# EasyEDA Pro project MSDRv4.eprj

# Schematic Schematic1
Board Name: Board1; Create Date: 2025-03-24; Page Name: P1; Project Name: MSDRv4; Schematic Name: Schematic1; Update Date: 2025-03-28; Company: EasyEDA.com; Page Size: A4; Version: V1.0
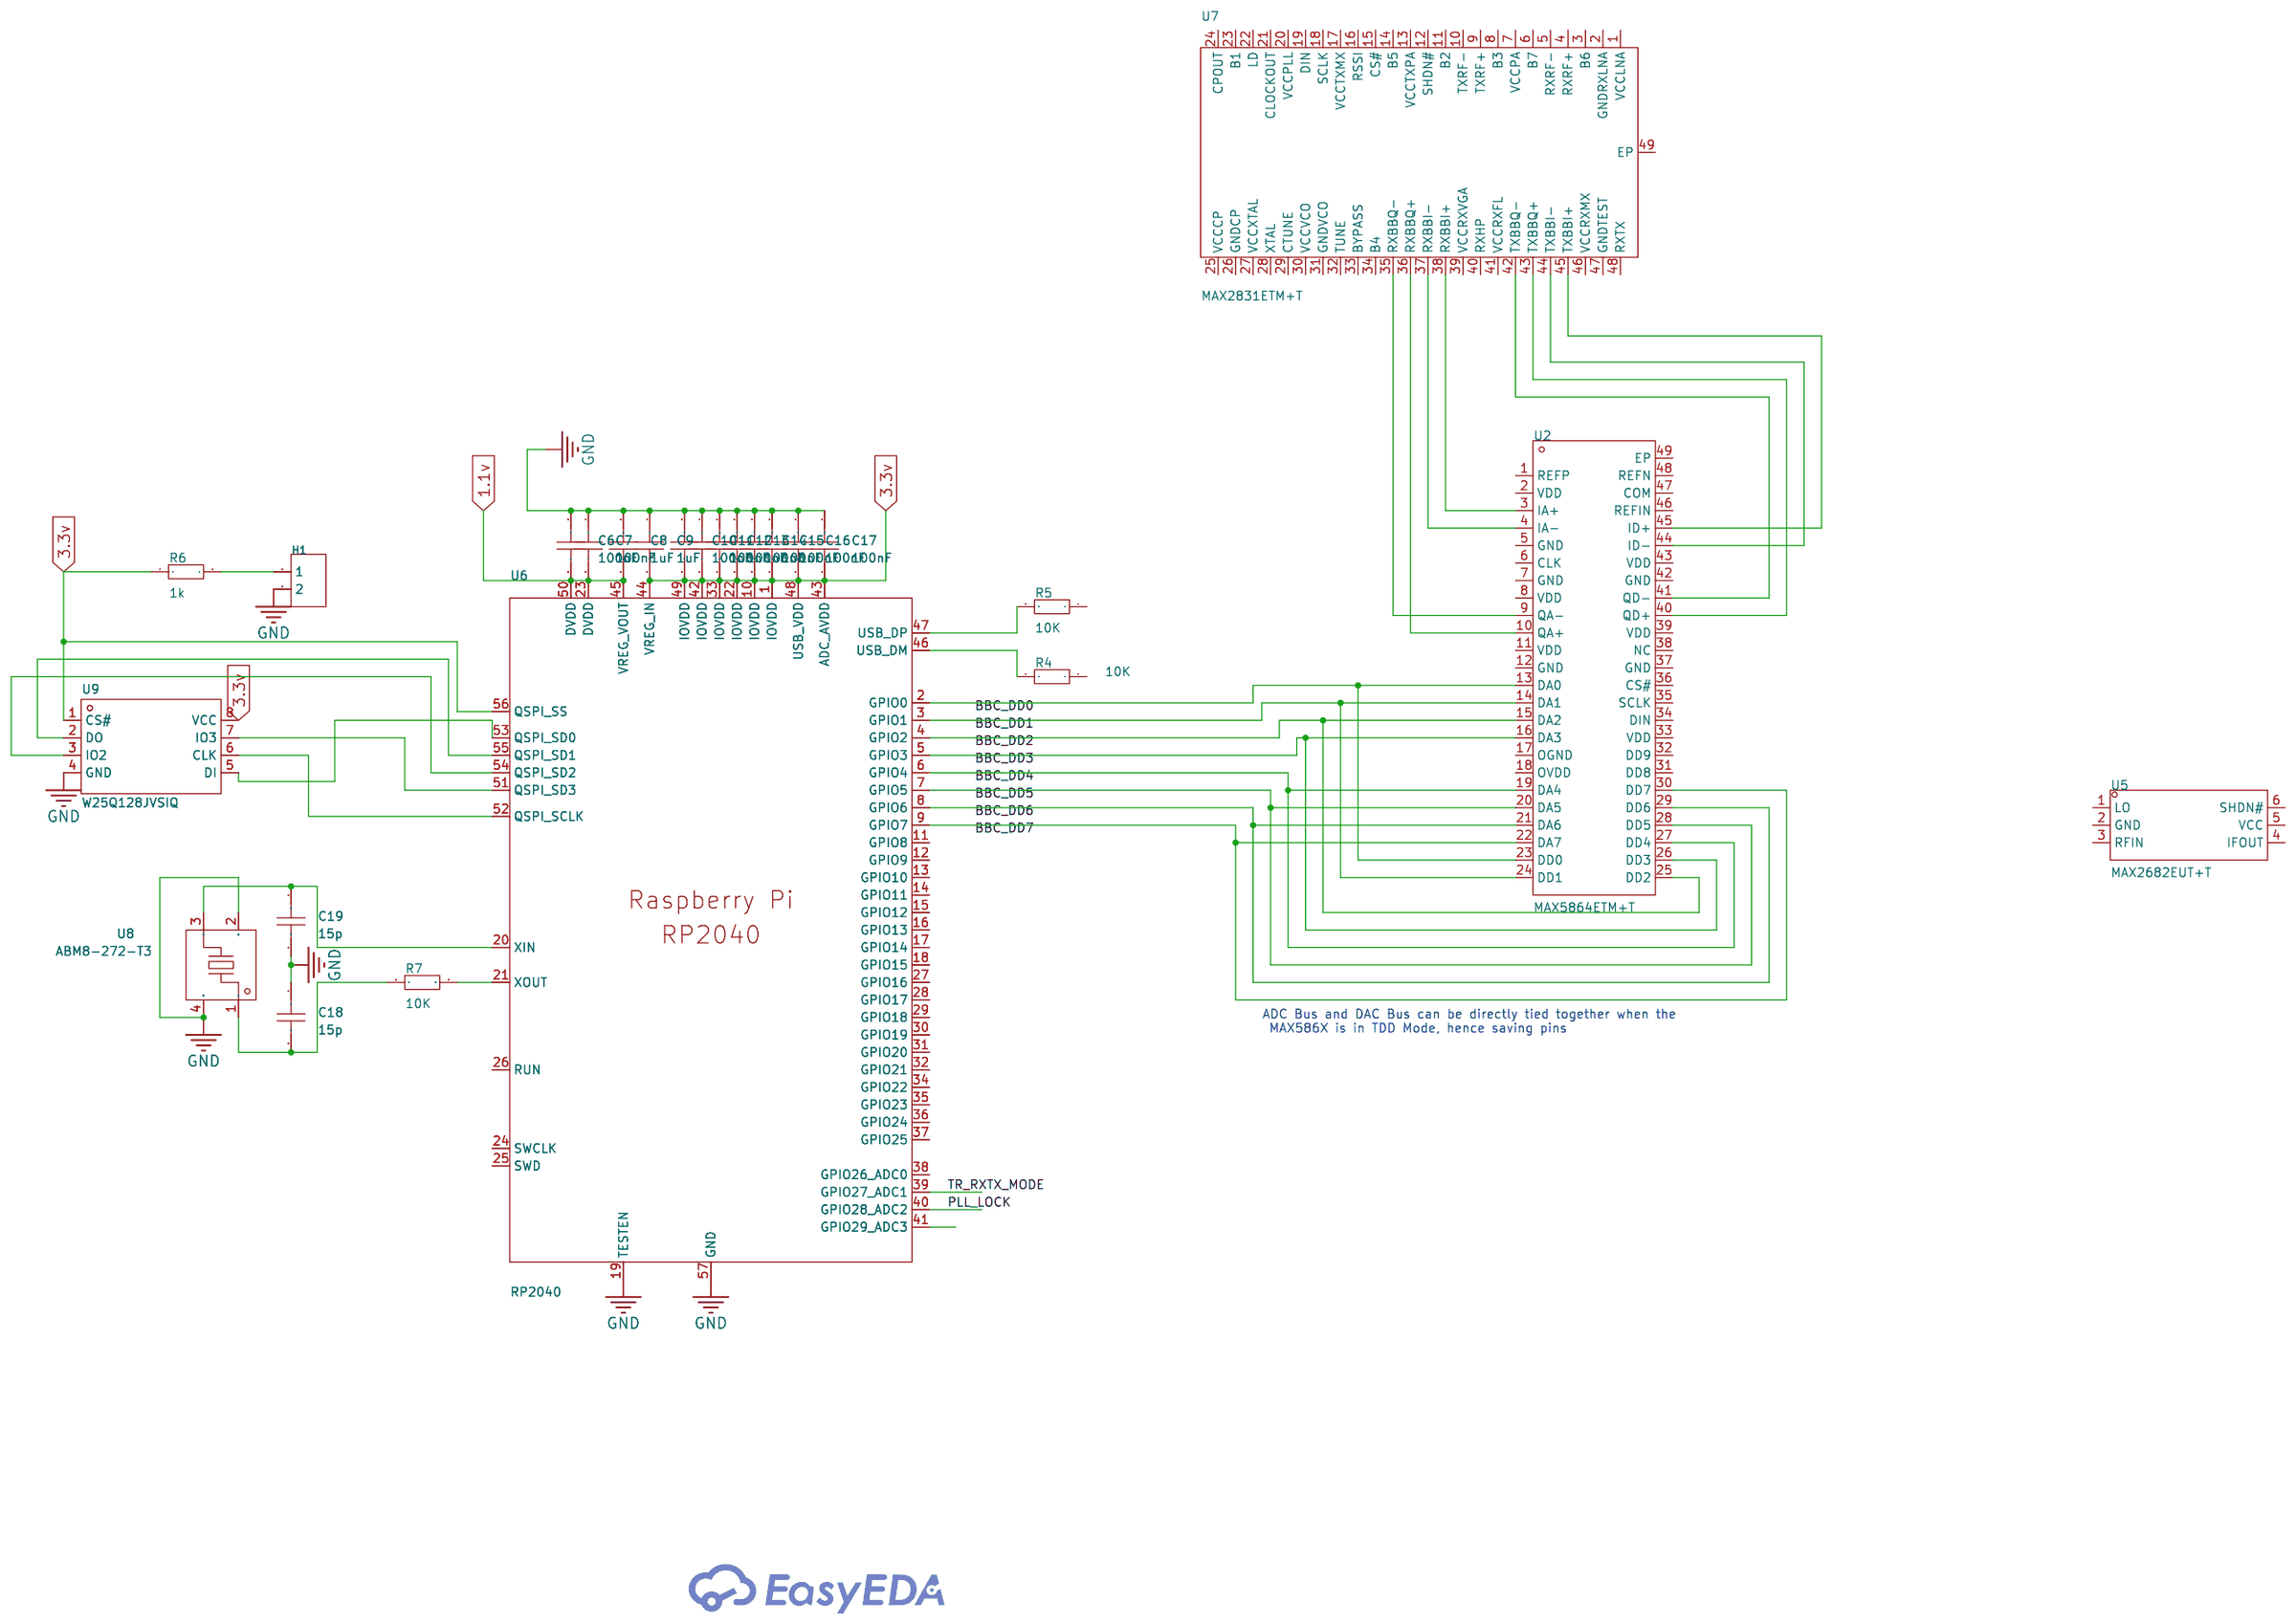
[diagram p0: schematic sheet]

## Parts
C6  100nF  [C0402]
C7  100nF  [C0402]
C8  1uF  [C0402]
C9  1uF  [C0402]
C10  100nF  [C0402]
C11  100nF  [C0402]
C12  100nF  [C0402]
C13  100nF  [C0402]
C14  100nF  [C0402]
C15  100nF  [C0402]
C16  100nF  [C0402]
C17  100nF  [C0402]
C18  15p  [C0402]
C19  15p  [C0402]
H1  -  [HDR-TH_2P-P2.54-V-F]
R4  10K  [R0402]
R5  10K  [R0402]
R6  1k  [R0402]
R7  10K  [R0402]
U2  MAX5864ETM+T  [QFN-48_L7.0-W7.0-P0.50-BL-EP5.6]
U5  MAX2682EUT+T  [SOT-23-6_L2.9-W1.6-P0.95-LS2.8-TL]
U6  RP2040  [LQFN-56_L7.0-W7.0-P0.4-EP]
U7  MAX2831ETM+T  [TQFN-48_L7.0-W7.0-P0.50-TL-EP5.6]
U8  ABM8-272-T3  [CRYSTAL-SMD_4P-L3.2-W2.5-BL]
U9  W25Q128JVSIQ  [SOIC-8_L5.3-W5.3-P1.27-LS8.0-BL]

## Library data of the parts
C6-C19 = CAP_0402: Supplier Part: C1525; Supplier Footprint: 0402
H1 = HDR-F_2.54_1x2P: Supplier Footprint: Through
R4-R7 = Res_0402: Supplier Footprint: 0402
U2 = MAX5864ETM+T: LCSC Part Name: 超低功耗、高性能、22Msps模拟前端; Supplier Part: C2651650; Manufacturer: ADI(亚德诺)/MAXIM(美信); Supplier Footprint: QFN-48-EP(7x7); JLCPCB Part Class: Extended Part; Datasheet: https://atta.szlcsc.com/upload/public/pdf/source/20171204/C143525_15123772477351162683.pdf; Supplier: LCSC; Supply Voltage: 2.7V~3.3V
U5 = MAX2682EUT+T: LCSC Part Name: 400MHz至2.5GHz、低噪声、SiGe下变频混频器; Supplier Part: C242518; Manufacturer: ADI(亚德诺)/MAXIM(美信); Supplier Footprint: SOT-23-6; JLCPCB Part Class: Extended Part; Datasheet: https://atta.szlcsc.com/upload/public/pdf/source/20180803/C242518_65486365110A18DF443AB56BC6A2A83D.pdf; Supplier: LCSC; Applications: Mobile Phone；PCS；ISM；WLL; Frequency Range: 400MHz~2500MHz; Gain/Loss: 14.7dB; Noise Figure: 6.5dB; Supply Voltage: 2.7V~5.5V; Supply Current: 15mA; Operating Temperature: -40℃~+85℃
U6 = RP2040_C2040: LCSC Part Name: RP2040（RP2B2）; Supplier Part: C2040; Manufacturer: Raspberry Pi(树莓派); Supplier Footprint: LQFN-56(7x7); JLCPCB Part Class: Extended Part; Datasheet: https://atta.szlcsc.com/upload/public/pdf/source/20210621/C2040_96F425825606B7957D87DD32E2512CA9.pdf; Supplier: LCSC; CPU Maximum Speed: 133MHz; Number of I/O: 30; ADC (Bit): 12bit; RAM Size: 264KB; GPIO Ports Number: 30; UART/USART: 2; I2C: 2; SPI: 2; Universal Serial Bus: 有; Peripheral/Function: DMA；PWM; Direct Memory Access: 有
U7 = MAX2831ETM+T: LCSC Part Name: 2.4GHz至2.5GHz、802.11g RF收发器，集成PA; Supplier Part: C2152047; Manufacturer: ADI(亚德诺)/MAXIM(美信); Supplier Footprint: TQFN-48-EP(7x7); JLCPCB Part Class: Extended Part; Datasheet: https://atta.szlcsc.com/upload/public/pdf/source/20210601/D5E13A4F591163B65DE03F91E5182685.pdf; Supplier: LCSC; Frequency Range: 2.4GHz~2.5GHz; Interface: SPI; Operating Voltage: 2.7V~3.6V; Applications: WiFi; Output Power: 21dBm; Data Rate: 54Mbps; Current Of Transmitting: 82mA; Sensitivity: -76dBm; Receive Current: 62mA; Operating Temperature: -40℃~+85℃
U8 = ABM8-272-T3_C20625731: Supplier Part: C20625731; Manufacturer: ABRACON; Supplier Footprint: SMD3225-4P; JLCPCB Part Class: Extended Part; Datasheet: https://atta.szlcsc.com/upload/public/pdf/source/20240227/A8BE43F636D80F75C9AF5C59EDF21E9A.pdf; Supplier: LCSC
U9 = W25Q128JVSIQ: Interface Type:- Memory Size:128Mbit Clock Frequency (fc):- Supply Voltage:- Supply Voltage:- Supply Current (Read):- Supply Current (Program):- Supply Current (Erase):- Standby supply current:- Page Programming Time (Tpp):- Block Erase Time (tBE):- Data; LCSC Part Name: W25Q128JVSIQ 编带; Supplier Part: C97521; Manufacturer: WINBOND(华邦); Supplier Footprint: SOIC-8-208mil; JLCPCB Part Class: Basic Part; Datasheet: https://atta.szlcsc.com/upload/public/pdf/source/20170316/1489627409956.pdf; Supplier: LCSC; Memory Size: 128Mbit

## Nets
1.1v: C6.2 C7.2 C8.2 U6.23(DVDD) U6.45(VREG_VOUT) U6.50(DVDD)
3.3v: C9.2 C10.2 C11.2 C12.2 C13.2 C14.2 C15.2 C16.2 C17.2 R6.1 U6.1(IOVDD) U6.10(IOVDD) U6.22(IOVDD) U6.33(IOVDD) U6.42(IOVDD) U6.43(ADC_AVDD) U6.44(VREG_IN) U6.48(USB_VDD) U6.49(IOVDD) U6.56(QSPI_SS) U9.1(CS#) U9.8(VCC)
GND: C6.1 C7.1 C8.1 C9.1 C10.1 C11.1 C12.1 C13.1 C14.1 C15.1 C16.1 C17.1 C18.1 C19.2 H1.2 U6.19(TESTEN) U6.57(GND) U8.2(GND) U8.4(GND) U9.4(GND)
BBC_DD0: U2.13(DA0) U2.23(DD0) U6.2(GPIO0)
BBC_DD1: U2.14(DA1) U2.24(DD1) U6.3(GPIO1)
BBC_DD2: U2.15(DA2) U2.25(DD2) U6.4(GPIO2)
BBC_DD3: U2.16(DA3) U2.26(DD3) U6.5(GPIO3)
BBC_DD4: U2.19(DA4) U2.27(DD4) U6.6(GPIO4)
BBC_DD5: U2.20(DA5) U2.28(DD5) U6.7(GPIO5)
BBC_DD6: U2.21(DA6) U2.29(DD6) U6.8(GPIO6)
BBC_DD7: U2.22(DA7) U2.30(DD7) U6.9(GPIO7)
PLL_LOCK: U6.40(GPIO28_ADC2)
TR_RXTX_MODE: U6.39(GPIO27_ADC1)
$1N2296: R5.2 U6.47(USB_DP)
$1N2297: R4.2 U6.46(USB_DM)
$1N2305: U6.51(QSPI_SD3) U9.7(IO3)
$1N2306: U6.54(QSPI_SD2) U9.3(IO2)
$1N2307: U6.53(QSPI_SD0) U9.5(DI)
$1N2308: U6.55(QSPI_SD1) U9.2(DO)
$1N2309: U6.52(QSPI_SCLK) U9.6(CLK)
$1N2311: H1.1 R6.2
$1N2314: C19.1 U6.20(XIN) U8.3
$1N2316: C18.2 R7.1 U8.1
$1N2317: R7.2 U6.21(XOUT)
$1N2860: U2.9(QA-) U7.35(RXBBQ-)
$1N2892: U2.10(QA+) U7.36(RXBBQ+)
$1N2897: U2.4(IA-) U7.37(RXBBI-)
$1N2903: U2.3(IA+) U7.38(RXBBI+)
$1N2909: U2.41(QD-) U7.42(TXBBQ-)
$1N2917: U2.40(QD+) U7.43(TXBBQ+)
$1N2925: U2.44(ID-) U7.44(TXBBI-)
$1N2933: U2.45(ID+) U7.45(TXBBI+)

Not connected (* = marked no-connect by the designer): R4 1; R5 1; U2 1(REFP) 2(VDD) 5(GND) 6(CLK) 7(GND) 8(VDD) 11(VDD) 12(GND) 17(OGND) 18(OVDD) 31(DD8) 32(DD9) 33(VDD) 34(DIN) 35(SCLK) 36(CS#) 37(GND) 38(NC) 39(VDD) 42(GND) 43(VDD) 46(REFIN) 47(COM) 48(REFN) 49(EP); U5 1(LO) 2(GND) 3(RFIN) 4(IFOUT) 5(VCC) 6(SHDN#); U6 11(GPIO8) 12(GPIO9) 13(GPIO10) 14(GPIO11) 15(GPIO12) 16(GPIO13) 17(GPIO14) 18(GPIO15) 24(SWCLK) 25(SWD) 26(RUN) 27(GPIO16) 28(GPIO17) 29(GPIO18) 30(GPIO19) 31(GPIO20) 32(GPIO21) 34(GPIO22) 35(GPIO23) 36(GPIO24) 37(GPIO25) 38(GPIO26_ADC0) 41(GPIO29_ADC3); U7 1(VCCLNA) 2(GNDRXLNA) 3(B6) 4(RXRF+) 5(RXRF-) 6(B7) 7(VCCPA) 8(B3) 9(TXRF+) 10(TXRF-) 11(B2) 12(SHDN#) 13(VCCTXPA) 14(B5) 15(CS#) 16(RSSI) 17(VCCTXMX) 18(SCLK) 19(DIN) 20(VCCPLL) 21(CLOCKOUT) 22(LD) 23(B1) 24(CPOUT) 25(VCCCP) 26(GNDCP) 27(VCCXTAL) 28(XTAL) 29(CTUNE) 30(VCCVCO) 31(GNDVCO) 32(TUNE) 33(BYPASS) 34(B4) 39(VCCRXVGA) 40(RXHP) 41(VCCRXFL) 46(VCCRXMX) 47(GNDTEST) 48(RXTX) 49(EP)

## Notes on the sheet
- ADC Bus and DAC Bus can be directly tied together when the
   MAX586X is in TDD Mode, hence saving pins

# Schematic BBC_2024_REUSE
Board Name: BBC_2024_REUSE; Create Date: 2024-12-31; Page Name: P1; Project Name: BBC_2024_REUSE; Schematic Name: BBC_2024_REUSE; Update Date: 2024-12-31; Company: EasyEDA.com; Page Size: A4; Version: V1.0
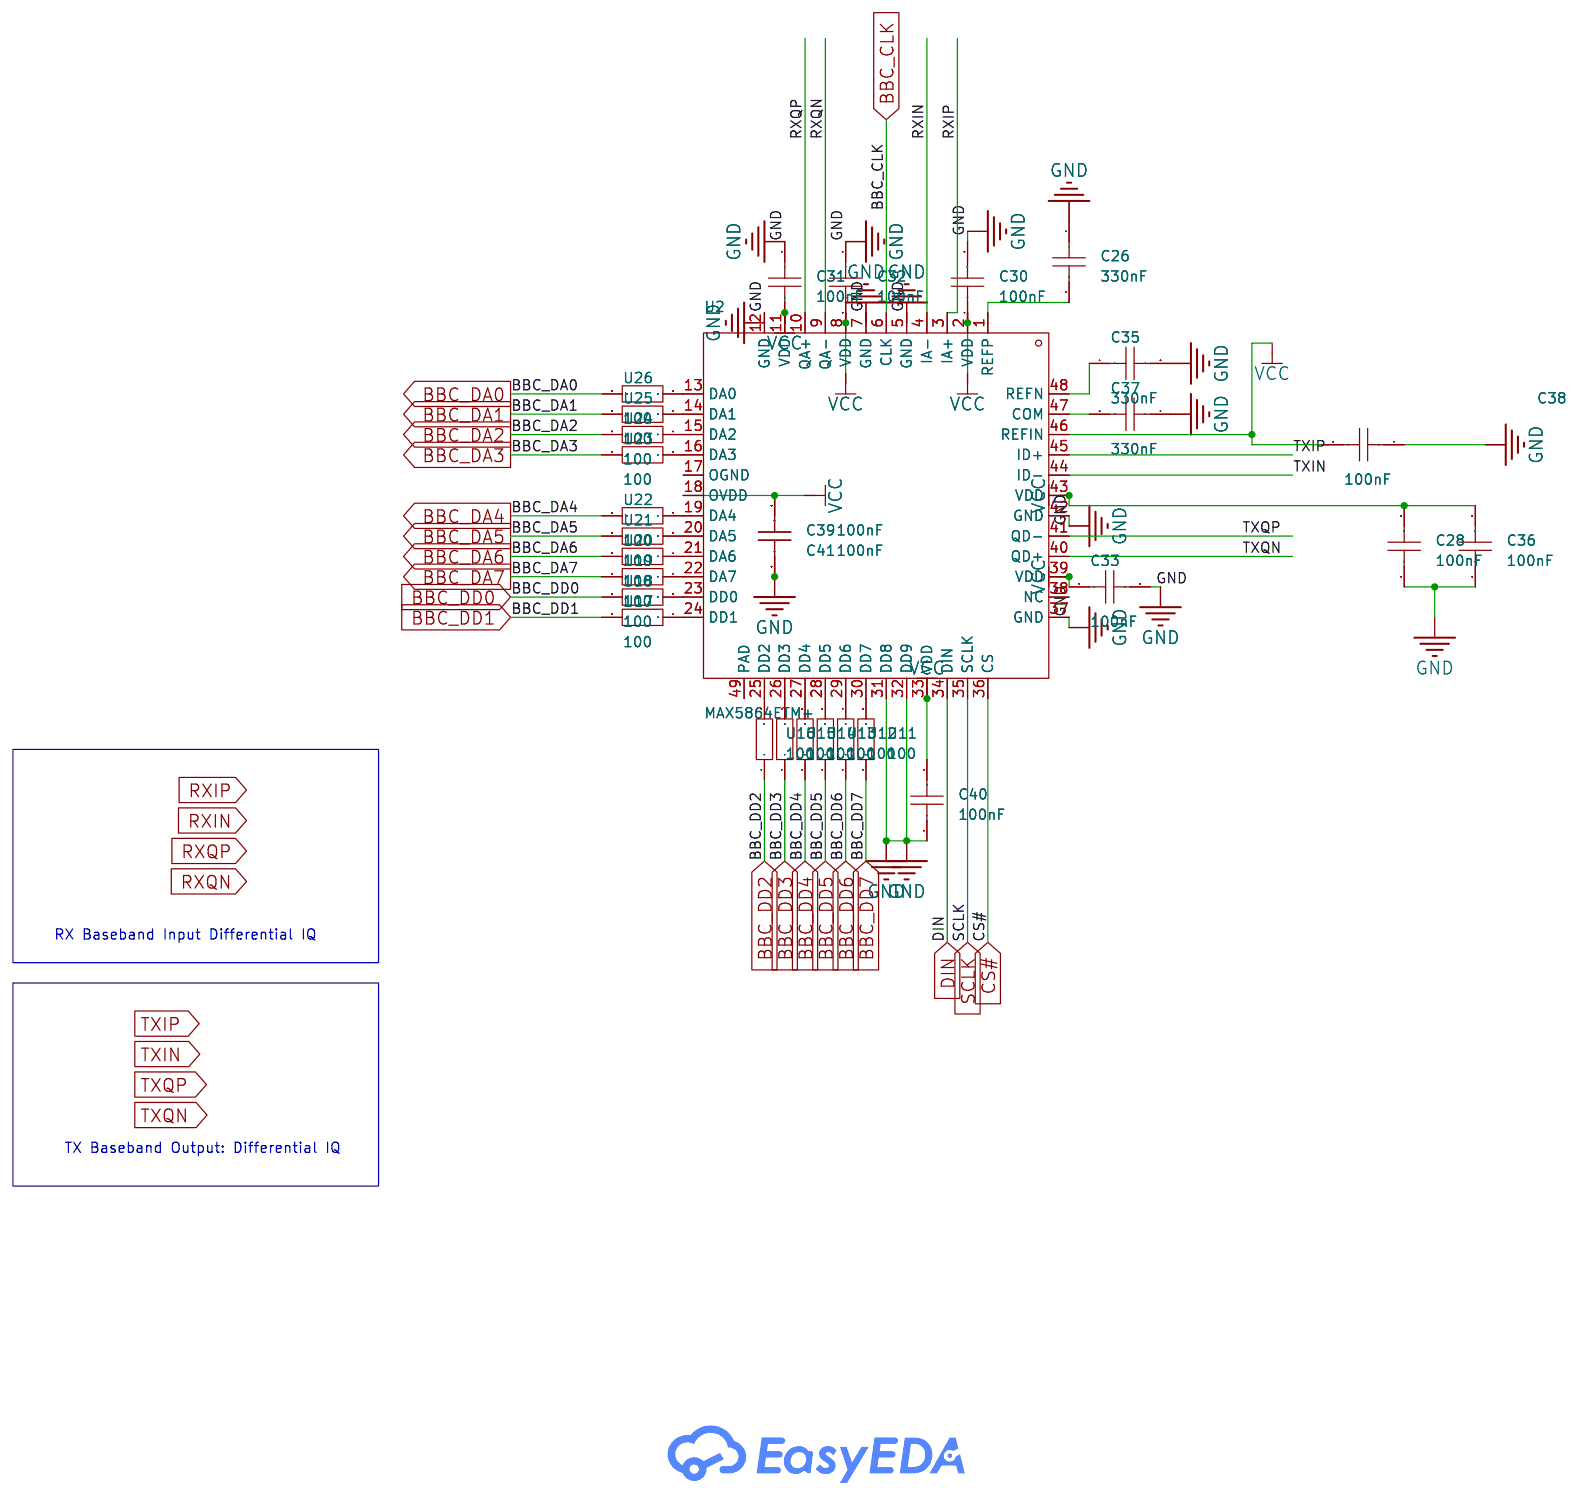
[diagram p1: schematic sheet]

## Parts
C26  330nF  [C0805]
C28  100nF  [C0805]
C30  100nF  [C0805]
C31  100nF  [C0805]
C32  100nF  [C0805]
C33  100nF  [C0805]
C35  330nF  [C0805]
C36  100nF  [C0805]
C37  330nF  [C0805]
C38  100nF  [C0805]
C39  100nF  [C0805]
C40  100nF  [C0805]
C41  100nF  [C0805]
U2  MAX5864ETM+  [QFN-48_L7.0-W7.0-P0.50-BL-EP5.1]
U11  100  [R0805]
U12  100  [R0805]
U13  100  [R0805]
U14  100  [R0805]
U15  100  [R0805]
U16  100  [R0805]
U17  100  [R0805]
U18  100  [R0805]
U19  100  [R0805]
U20  100  [R0805]
U21  100  [R0805]
U22  100  [R0805]
U23  100  [R0805]
U24  100  [R0805]
U25  100  [R0805]
U26  100  [R0805]

## Library data of the parts
C26 C28 C30-C33 C35-C41 = CAP_0805: Supplier Footprint: 0805
U2 = MAX5864ETM+: Supply Voltage:2.7V~3.3V Supply Voltage:2.7V~3.3V; LCSC Part Name: MAX5864ETM; Supplier Part: C143525; Manufacturer: ADI(亚德诺)/MAXIM(美信); Supplier Footprint: QFN-48-EP(7x7); JLCPCB Part Class: Extended Part; Datasheet: https://atta.szlcsc.com/upload/public/pdf/source/20171204/C143525_15123772477351162683.pdf; Supplier: LCSC; Supply Voltage: 2.7V~3.3V
U11-U26 = 3R00: Supplier Part: C9900008006; JLCPCB Part Class: Extended Part; Supplier: LCSC

## Nets
GND: C26.1 C28.1 C30.2 C31.1 C32.1 C33.2 C35.2 C36.1 C37.1 C38.1 C39.1 C40.1 C41.1 U2.5(GND) U2.7(GND) U2.12(GND) U2.31(DD8) U2.32(DD9) U2.37(GND) U2.42(GND)
VCC: C28.2 C30.1 C31.2 C32.2 C33.1 C36.2 C38.2 C39.2 C40.2 C41.2 U2.2(VDD) U2.8(VDD) U2.11(VDD) U2.18(OVDD) U2.33(VDD) U2.39(VDD) U2.43(VDD) U2.46(REFIN)
BBC_CLK: U2.6(CLK)
BBC_DA0: U26.2
BBC_DA1: U25.2
BBC_DA2: U24.2
BBC_DA3: U23.2
BBC_DA4: U22.2
BBC_DA5: U21.2
BBC_DA6: U20.2
BBC_DA7: U19.2
BBC_DD0: U18.2
BBC_DD1: U17.2
BBC_DD2: U16.1
BBC_DD3: U15.1
BBC_DD4: U14.1
BBC_DD5: U13.1
BBC_DD6: U12.1
BBC_DD7: U11.1
CS#: U2.36(CS)
DIN: U2.34(DIN)
RXIN: U2.4(IA-)
RXIP: U2.3(IA+)
RXQN: U2.9(QA-)
RXQP: U2.10(QA+)
SCLK: U2.35(SCLK)
TXIN: U2.44(ID-)
TXIP: U2.45(ID+)
TXQN: U2.40(QD+)
TXQP: U2.41(QD-)
$1N1602: C37.2 U2.47(COM)
$1N1605: U2.30(DD7) U11.2
$1N1608: U2.29(DD6) U12.2
$1N1611: U2.28(DD5) U13.2
$1N1614: U2.27(DD4) U14.2
$1N1617: U2.26(DD3) U15.2
$1N1620: U2.25(DD2) U16.2
$1N1625: U2.24(DD1) U17.1
$1N1628: U2.23(DD0) U18.1
$1N1633: U2.21(DA6) U20.1
$1N1636: U2.20(DA5) U21.1
$1N1639: U2.19(DA4) U22.1
$1N1642: U2.16(DA3) U23.1
$1N1645: U2.15(DA2) U24.1
$1N1648: U2.14(DA1) U25.1
$1N1651: U2.13(DA0) U26.1
$1N1653: C35.1 U2.48(REFN)
$1N1654: C26.2 U2.1(REFP)
$1N1662: U2.22(DA7) U19.1

Not connected (* = marked no-connect by the designer): U2 17(OGND) 38(NC) 49(PAD)

## Notes on the sheet
- RX Baseband Input Differential IQ
- TX Baseband Output: Differential IQ

# Schematic Schematic2
Board Name: Board2; Create Date: 2025-03-29; Page Name: P1; Project Name: MSDRv4; Schematic Name: Schematic2; Update Date: 2025-03-29; Company: EasyEDA.com; Page Size: A4; Version: V1.0
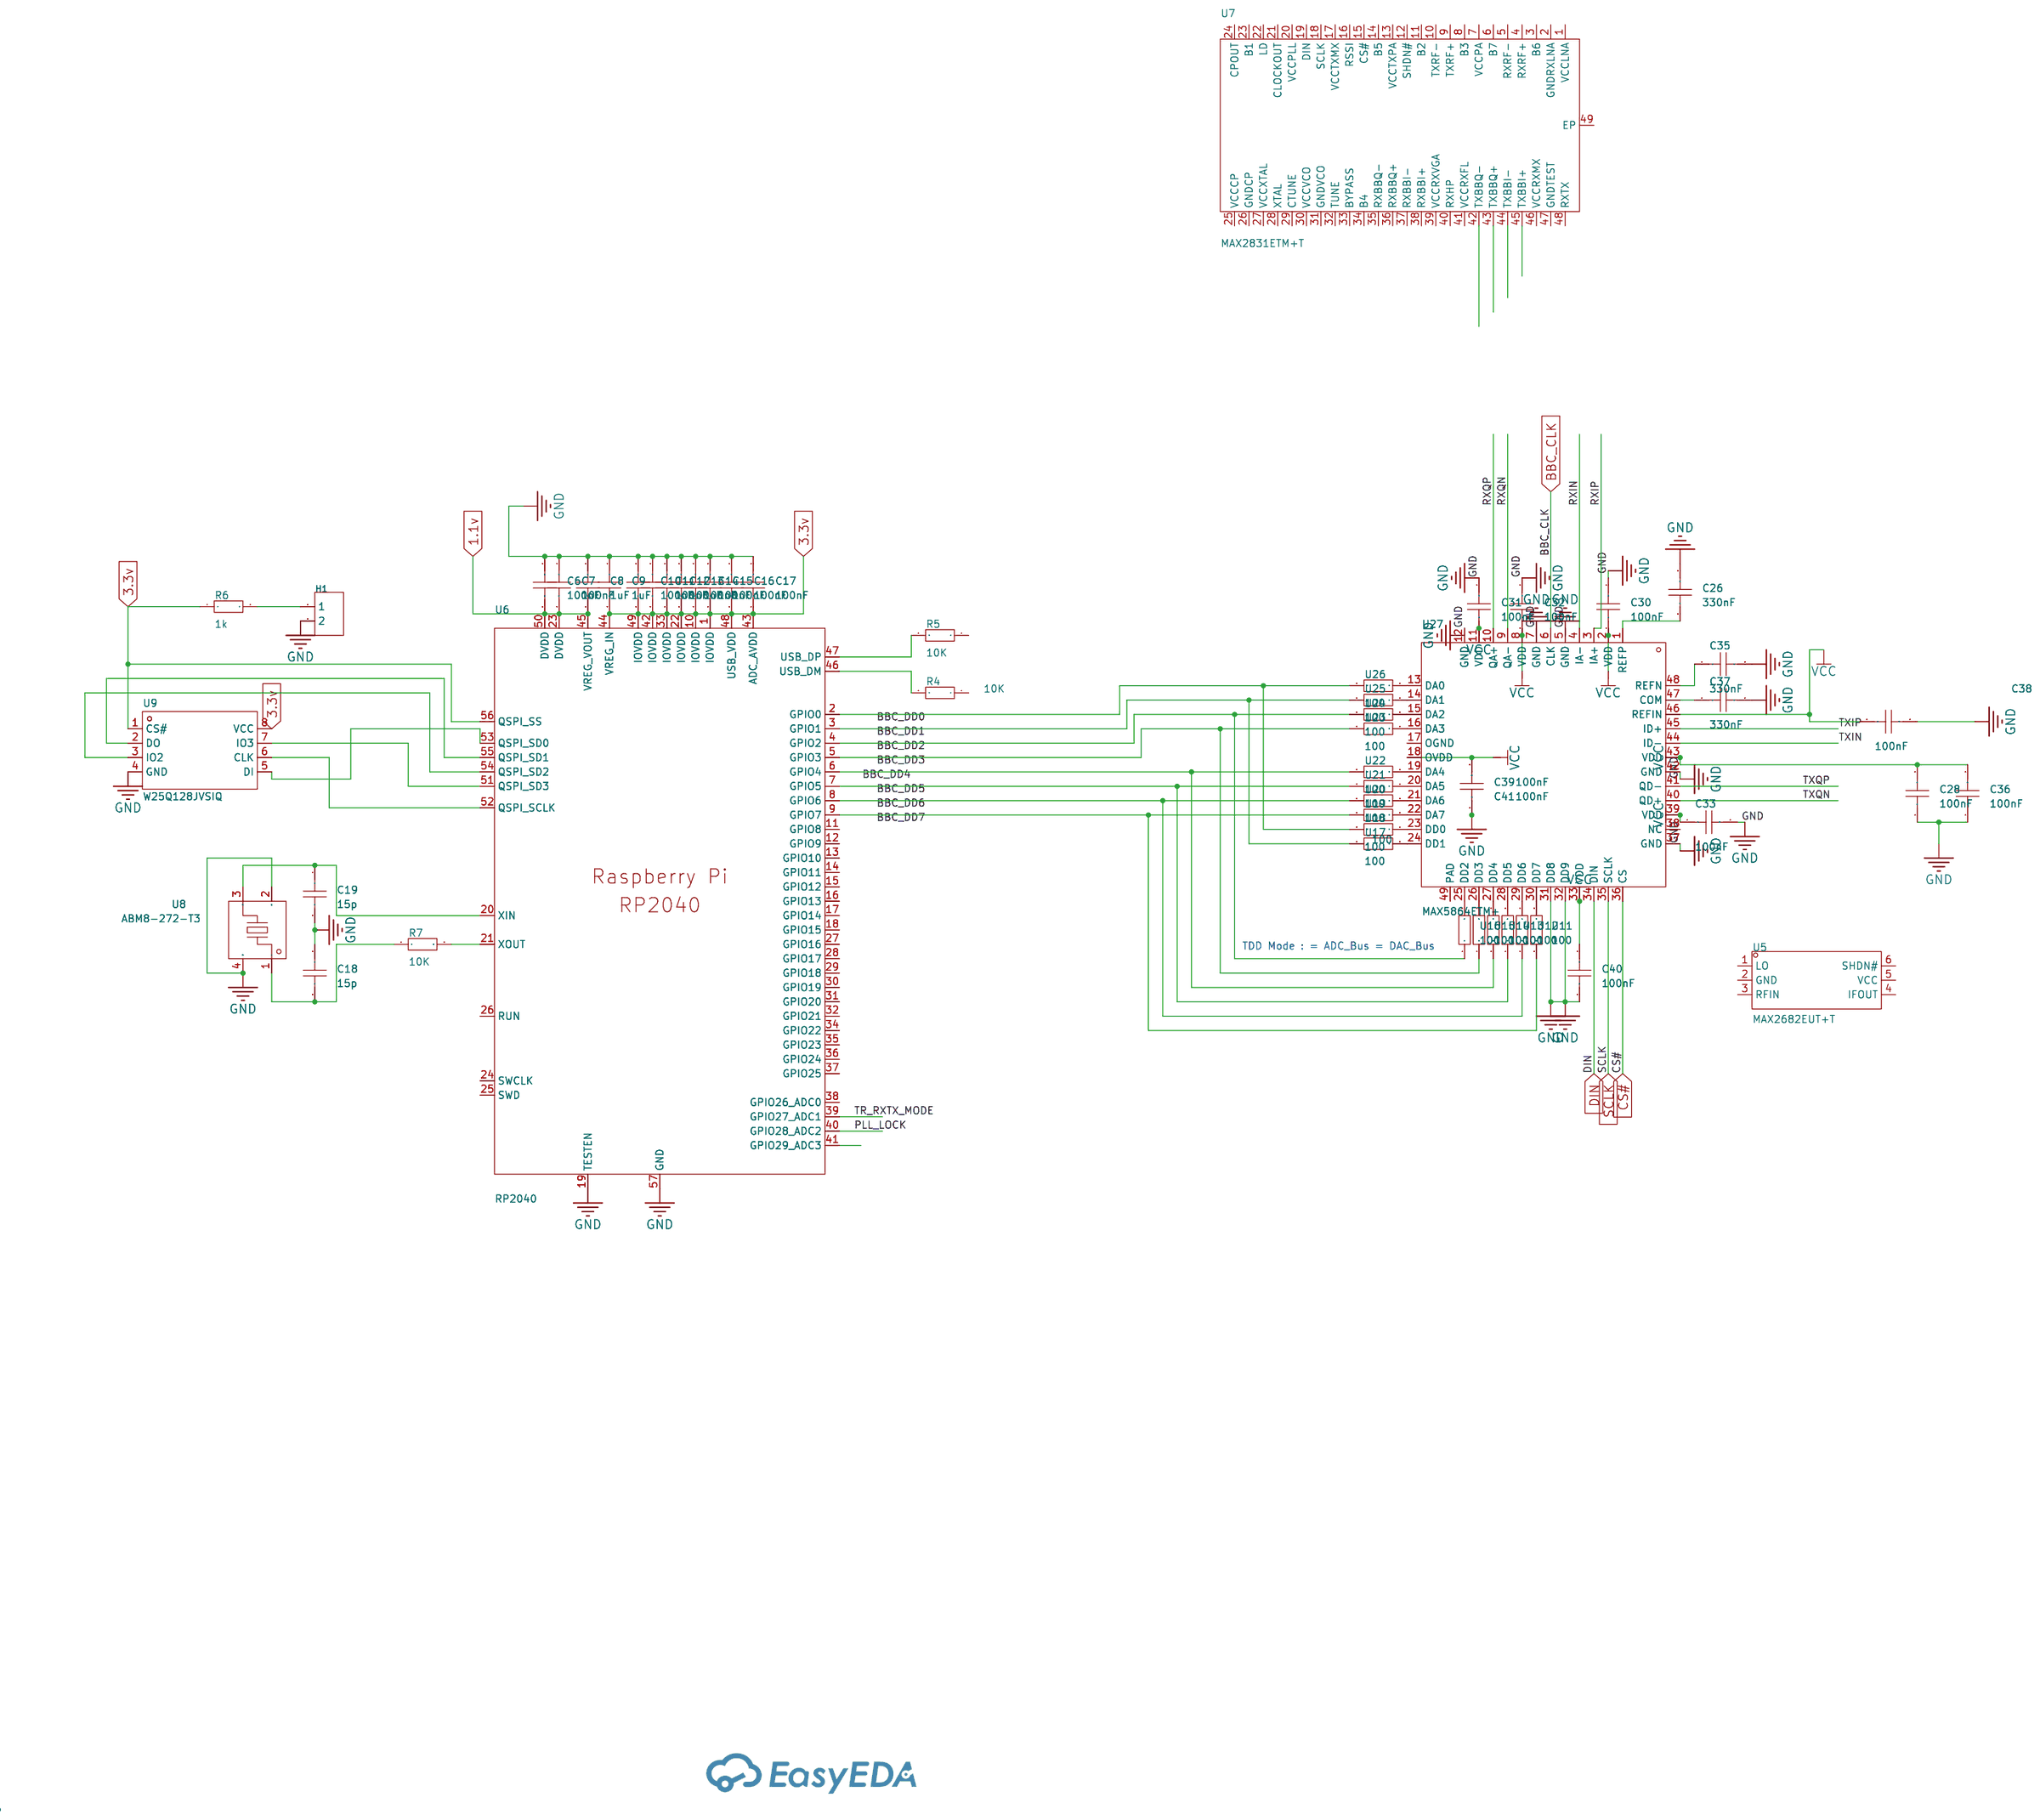
[diagram p2: schematic sheet]

## Parts
C6  100nF  [C0402]
C7  100nF  [C0402]
C8  1uF  [C0402]
C9  1uF  [C0402]
C10  100nF  [C0402]
C11  100nF  [C0402]
C12  100nF  [C0402]
C13  100nF  [C0402]
C14  100nF  [C0402]
C15  100nF  [C0402]
C16  100nF  [C0402]
C17  100nF  [C0402]
C18  15p  [C0402]
C19  15p  [C0402]
C26  330nF  [C0805]
C28  100nF  [C0805]
C30  100nF  [C0805]
C31  100nF  [C0805]
C32  100nF  [C0805]
C33  100nF  [C0805]
C35  330nF  [C0805]
C36  100nF  [C0805]
C37  330nF  [C0805]
C38  100nF  [C0805]
C39  100nF  [C0805]
C40  100nF  [C0805]
C41  100nF  [C0805]
H1  -  [HDR-TH_2P-P2.54-V-F]
R4  10K  [R0402]
R5  10K  [R0402]
R6  1k  [R0402]
R7  10K  [R0402]
U5  MAX2682EUT+T  [SOT-23-6_L2.9-W1.6-P0.95-LS2.8-TL]
U6  RP2040  [LQFN-56_L7.0-W7.0-P0.4-EP]
U7  MAX2831ETM+T  [TQFN-48_L7.0-W7.0-P0.50-TL-EP5.6]
U8  ABM8-272-T3  [CRYSTAL-SMD_4P-L3.2-W2.5-BL]
U9  W25Q128JVSIQ  [SOIC-8_L5.3-W5.3-P1.27-LS8.0-BL]
U11  100  [R0805]
U12  100  [R0805]
U13  100  [R0805]
U14  100  [R0805]
U15  100  [R0805]
U16  100  [R0805]
U17  100  [R0805]
U18  100  [R0805]
U19  100  [R0805]
U20  100  [R0805]
U21  100  [R0805]
U22  100  [R0805]
U23  100  [R0805]
U24  100  [R0805]
U25  100  [R0805]
U26  100  [R0805]
U27  MAX5864ETM+  [QFN-48_L7.0-W7.0-P0.50-BL-EP5.1]

## Library data of the parts
C6-C19 = CAP_0402: Supplier Part: C1525; Supplier Footprint: 0402
C26 C28 C30-C33 C35-C41 = CAP_0805: Supplier Footprint: 0805
H1 = HDR-F_2.54_1x2P: Supplier Footprint: Through
R4-R7 = Res_0402: Supplier Footprint: 0402
U5 = MAX2682EUT+T: LCSC Part Name: 400MHz至2.5GHz、低噪声、SiGe下变频混频器; Supplier Part: C242518; Manufacturer: ADI(亚德诺)/MAXIM(美信); Supplier Footprint: SOT-23-6; JLCPCB Part Class: Extended Part; Datasheet: https://atta.szlcsc.com/upload/public/pdf/source/20180803/C242518_65486365110A18DF443AB56BC6A2A83D.pdf; Supplier: LCSC; Applications: Mobile Phone；PCS；ISM；WLL; Frequency Range: 400MHz~2500MHz; Gain/Loss: 14.7dB; Noise Figure: 6.5dB; Supply Voltage: 2.7V~5.5V; Supply Current: 15mA; Operating Temperature: -40℃~+85℃
U6 = RP2040_C2040: LCSC Part Name: RP2040（RP2B2）; Supplier Part: C2040; Manufacturer: Raspberry Pi(树莓派); Supplier Footprint: LQFN-56(7x7); JLCPCB Part Class: Extended Part; Datasheet: https://atta.szlcsc.com/upload/public/pdf/source/20210621/C2040_96F425825606B7957D87DD32E2512CA9.pdf; Supplier: LCSC; CPU Maximum Speed: 133MHz; Number of I/O: 30; ADC (Bit): 12bit; RAM Size: 264KB; GPIO Ports Number: 30; UART/USART: 2; I2C: 2; SPI: 2; Universal Serial Bus: 有; Peripheral/Function: DMA；PWM; Direct Memory Access: 有
U7 = MAX2831ETM+T: LCSC Part Name: 2.4GHz至2.5GHz、802.11g RF收发器，集成PA; Supplier Part: C2152047; Manufacturer: ADI(亚德诺)/MAXIM(美信); Supplier Footprint: TQFN-48-EP(7x7); JLCPCB Part Class: Extended Part; Datasheet: https://atta.szlcsc.com/upload/public/pdf/source/20210601/D5E13A4F591163B65DE03F91E5182685.pdf; Supplier: LCSC; Frequency Range: 2.4GHz~2.5GHz; Interface: SPI; Operating Voltage: 2.7V~3.6V; Applications: WiFi; Output Power: 21dBm; Data Rate: 54Mbps; Current Of Transmitting: 82mA; Sensitivity: -76dBm; Receive Current: 62mA; Operating Temperature: -40℃~+85℃
U8 = ABM8-272-T3_C20625731: Supplier Part: C20625731; Manufacturer: ABRACON; Supplier Footprint: SMD3225-4P; JLCPCB Part Class: Extended Part; Datasheet: https://atta.szlcsc.com/upload/public/pdf/source/20240227/A8BE43F636D80F75C9AF5C59EDF21E9A.pdf; Supplier: LCSC
U9 = W25Q128JVSIQ: Interface Type:- Memory Size:128Mbit Clock Frequency (fc):- Supply Voltage:- Supply Voltage:- Supply Current (Read):- Supply Current (Program):- Supply Current (Erase):- Standby supply current:- Page Programming Time (Tpp):- Block Erase Time (tBE):- Data; LCSC Part Name: W25Q128JVSIQ 编带; Supplier Part: C97521; Manufacturer: WINBOND(华邦); Supplier Footprint: SOIC-8-208mil; JLCPCB Part Class: Basic Part; Datasheet: https://atta.szlcsc.com/upload/public/pdf/source/20170316/1489627409956.pdf; Supplier: LCSC; Memory Size: 128Mbit
U11-U26 = 3R00: Supplier Part: C9900008006; JLCPCB Part Class: Extended Part; Supplier: LCSC
U27 = MAX5864ETM+: Supply Voltage:2.7V~3.3V Supply Voltage:2.7V~3.3V; LCSC Part Name: MAX5864ETM; Supplier Part: C143525; Manufacturer: ADI(亚德诺)/MAXIM(美信); Supplier Footprint: QFN-48-EP(7x7); JLCPCB Part Class: Extended Part; Datasheet: https://atta.szlcsc.com/upload/public/pdf/source/20171204/C143525_15123772477351162683.pdf; Supplier: LCSC; Supply Voltage: 2.7V~3.3V

## Nets
1.1v: C6.2 C7.2 C8.2 U6.23(DVDD) U6.45(VREG_VOUT) U6.50(DVDD)
3.3v: C9.2 C10.2 C11.2 C12.2 C13.2 C14.2 C15.2 C16.2 C17.2 R6.1 U6.1(IOVDD) U6.10(IOVDD) U6.22(IOVDD) U6.33(IOVDD) U6.42(IOVDD) U6.43(ADC_AVDD) U6.44(VREG_IN) U6.48(USB_VDD) U6.49(IOVDD) U6.56(QSPI_SS) U9.1(CS#) U9.8(VCC)
GND: C6.1 C7.1 C8.1 C9.1 C10.1 C11.1 C12.1 C13.1 C14.1 C15.1 C16.1 C17.1 C18.1 C19.2 C26.1 C28.1 C30.2 C31.1 C32.1 C33.2 C35.2 C36.1 C37.1 C38.1 C39.1 C40.1 C41.1 H1.2 U6.19(TESTEN) U6.57(GND) U8.2(GND) U8.4(GND) U9.4(GND) U27.5(GND) U27.7(GND) U27.12(GND) U27.31(DD8) U27.32(DD9) U27.37(GND) U27.42(GND)
VCC: C28.2 C30.1 C31.2 C32.2 C33.1 C36.2 C38.2 C39.2 C40.2 C41.2 U27.2(VDD) U27.8(VDD) U27.11(VDD) U27.18(OVDD) U27.33(VDD) U27.39(VDD) U27.43(VDD) U27.46(REFIN)
BBC_CLK: U27.6(CLK)
BBC_DD0: U6.2(GPIO0) U18.2 U26.2
BBC_DD1: U6.3(GPIO1) U17.2 U25.2
BBC_DD2: U6.4(GPIO2) U16.1 U24.2
BBC_DD3: U6.5(GPIO3) U15.1 U23.2
BBC_DD4: U6.6(GPIO4) U14.1 U22.2
BBC_DD5: U6.7(GPIO5) U13.1 U21.2
BBC_DD6: U6.8(GPIO6) U12.1 U20.2
BBC_DD7: U6.9(GPIO7) U11.1 U19.2
CS#: U27.36(CS)
DIN: U27.34(DIN)
PLL_LOCK: U6.40(GPIO28_ADC2)
RXIN: U27.4(IA-)
RXIP: U27.3(IA+)
RXQN: U27.9(QA-)
RXQP: U27.10(QA+)
SCLK: U27.35(SCLK)
TR_RXTX_MODE: U6.39(GPIO27_ADC1)
TXIN: U27.44(ID-)
TXIP: U27.45(ID+)
TXQN: U27.40(QD+)
TXQP: U27.41(QD-)
Net-(C18-2): C18.2 R7.1 U8.1
Net-(C19-1): C19.1 U6.20(XIN) U8.3
Net-(C26-2): C26.2 U27.1(REFP)
Net-(C35-1): C35.1 U27.48(REFN)
Net-(C37-2): C37.2 U27.47(COM)
Net-(H1-1): H1.1 R6.2
Net-(R4-2): R4.2 U6.46(USB_DM)
Net-(R5-2): R5.2 U6.47(USB_DP)
Net-(R7-2): R7.2 U6.21(XOUT)
Net-(U6-51): U6.51(QSPI_SD3) U9.7(IO3)
Net-(U6-52): U6.52(QSPI_SCLK) U9.6(CLK)
Net-(U6-53): U6.53(QSPI_SD0) U9.5(DI)
Net-(U6-54): U6.54(QSPI_SD2) U9.3(IO2)
Net-(U6-55): U6.55(QSPI_SD1) U9.2(DO)
Net-(U11-2): U11.2 U27.30(DD7)
Net-(U12-2): U12.2 U27.29(DD6)
Net-(U13-2): U13.2 U27.28(DD5)
Net-(U14-2): U14.2 U27.27(DD4)
Net-(U15-2): U15.2 U27.26(DD3)
Net-(U16-2): U16.2 U27.25(DD2)
Net-(U17-1): U17.1 U27.24(DD1)
Net-(U18-1): U18.1 U27.23(DD0)
Net-(U19-1): U19.1 U27.22(DA7)
Net-(U20-1): U20.1 U27.21(DA6)
Net-(U21-1): U21.1 U27.20(DA5)
Net-(U22-1): U22.1 U27.19(DA4)
Net-(U23-1): U23.1 U27.16(DA3)
Net-(U24-1): U24.1 U27.15(DA2)
Net-(U25-1): U25.1 U27.14(DA1)
Net-(U26-1): U26.1 U27.13(DA0)

Not connected (* = marked no-connect by the designer): R4 1; R5 1; U5 1(LO) 2(GND) 3(RFIN) 4(IFOUT) 5(VCC) 6(SHDN#); U6 11(GPIO8) 12(GPIO9) 13(GPIO10) 14(GPIO11) 15(GPIO12) 16(GPIO13) 17(GPIO14) 18(GPIO15) 24(SWCLK) 25(SWD) 26(RUN) 27(GPIO16) 28(GPIO17) 29(GPIO18) 30(GPIO19) 31(GPIO20) 32(GPIO21) 34(GPIO22) 35(GPIO23) 36(GPIO24) 37(GPIO25) 38(GPIO26_ADC0) 41(GPIO29_ADC3); U7 1(VCCLNA) 2(GNDRXLNA) 3(B6) 4(RXRF+) 5(RXRF-) 6(B7) 7(VCCPA) 8(B3) 9(TXRF+) 10(TXRF-) 11(B2) 12(SHDN#) 13(VCCTXPA) 14(B5) 15(CS#) 16(RSSI) 17(VCCTXMX) 18(SCLK) 19(DIN) 20(VCCPLL) 21(CLOCKOUT) 22(LD) 23(B1) 24(CPOUT) 25(VCCCP) 26(GNDCP) 27(VCCXTAL) 28(XTAL) 29(CTUNE) 30(VCCVCO) 31(GNDVCO) 32(TUNE) 33(BYPASS) 34(B4) 35(RXBBQ-) 36(RXBBQ+) 37(RXBBI-) 38(RXBBI+) 39(VCCRXVGA) 40(RXHP) 41(VCCRXFL) 42(TXBBQ-) 43(TXBBQ+) 44(TXBBI-) 45(TXBBI+) 46(VCCRXMX) 47(GNDTEST) 48(RXTX) 49(EP); U27 17(OGND) 38(NC) 49(PAD)

## Notes on the sheet
- TDD Mode : = ADC_Bus = DAC_Bus

# Board PCB1
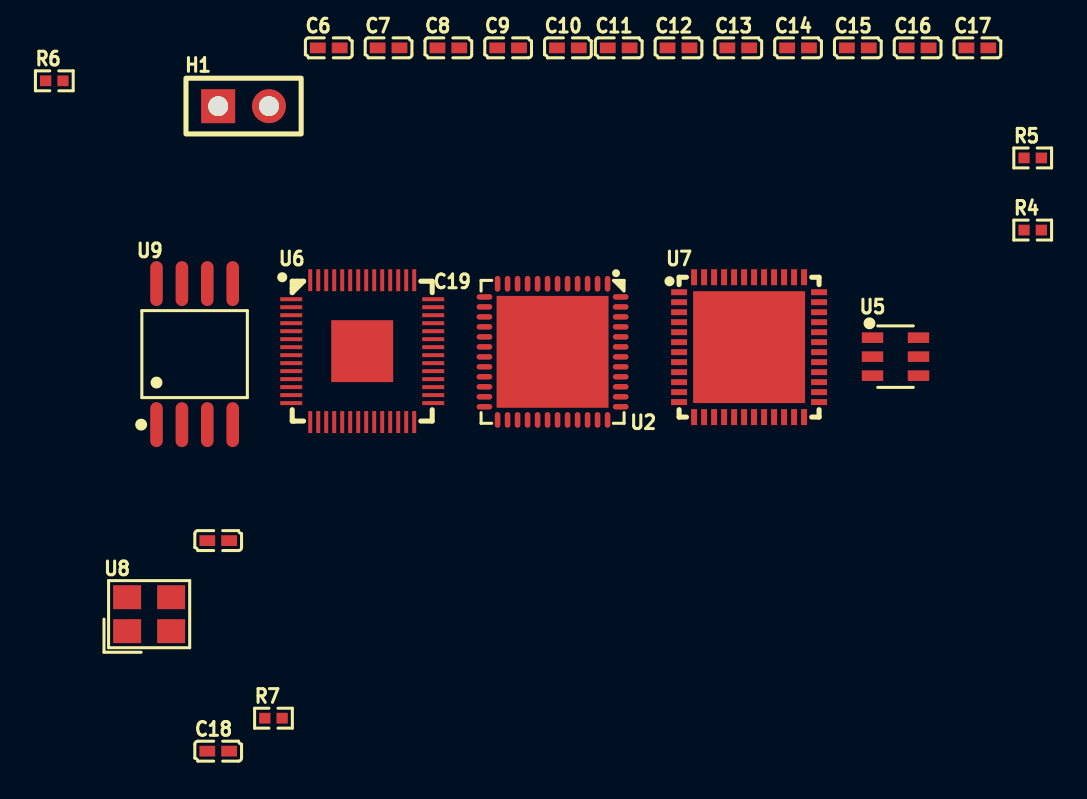
[diagram p3: board, top side]
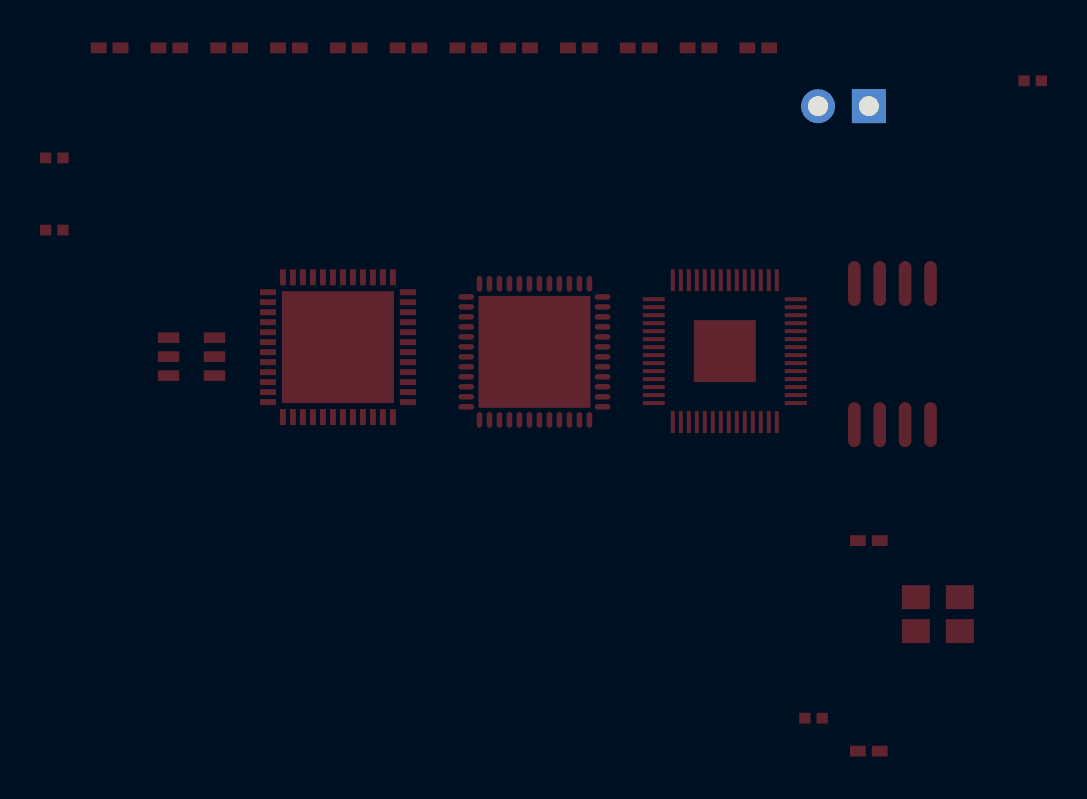
[diagram p4: board, bottom side, seen from below]

No outline. copper layers: Top Layer, Bottom Layer. Coordinates in mm from the lowest, leftmost part position.
Stack: Top Layer 0.035mm / Dielectric1 1.51mm FR4 er 4.5 / Bottom Layer 0.035mm

## Design rules (mm)
template: JLCPCB Capability(Two Layers Board)
spacing copperThickness1oz (default): track to track 0.102, other pairs 0.152 to 0.3
spacing copperThickness2oz: track to track 0.203, other pairs 0.152 to 0.3
track width copperThickness1oz (default): min 0.127, default 0.254, max 2.54
track width copperThickness2oz: min 0.203, default 0.254, max 2.54
differential pair differentialPair (default): width min 0.127, default 0.254, max 2.54; gap min 0.152, default 0.152
via viaSize (default): diameter min 0.5, default 0.61, max 10; hole min 0.3, default 0.305, max 6.3

## Placement (name value [footprint] x y rotation side)
C6  100nF  [C0402]  13.73 35.2 0 top
C7  100nF  [C0402]  16.72 35.2 0 top
C8  1uF  [C0402]  19.71 35.2 0 top
C9  1uF  [C0402]  22.7 35.2 0 top
C10  100nF  [C0402]  25.69 35.2 0 top
C11  100nF  [C0402]  28.23 35.2 0 top
C12  100nF  [C0402]  31.22 35.2 0 top
C13  100nF  [C0402]  34.21 35.2 0 top
C14  100nF  [C0402]  37.19 35.2 0 top
C15  100nF  [C0402]  40.18 35.2 0 top
C16  100nF  [C0402]  43.17 35.2 0 top
C17  100nF  [C0402]  46.16 35.2 0 top
C18  15p  [C0402]  8.2 0 0 top
C19  15p  [C0402]  8.2 10.54 0 top
H1  -  [HDR-TH_2P-P2.54-V-F]  9.47 32.28 0 top
R4  10K  [R0402]  48.93 26.08 0 top
R5  10K  [R0402]  48.93 29.69 0 top
R6  1k  [R0402]  0 33.55 0 top
R7  10K  [R0402]  10.96 1.65 0 top
U2  MAX5864ETM+T  [QFN-48_L7.0-W7.0-P0.50-BL-EP5.6]  24.92 19.99 180 top
U5  MAX2682EUT+T  [SOT-23-6_L2.9-W1.6-P0.95-LS2.8-TL]  42.07 19.75 0 top
U6  RP2040  [LQFN-56_L7.0-W7.0-P0.4-EP]  15.4 20.02 0 top
U7  MAX2831ETM+T  [TQFN-48_L7.0-W7.0-P0.50-TL-EP5.6]  34.75 20.22 0 top
U8  ABM8-272-T3  [CRYSTAL-SMD_4P-L3.2-W2.5-BL]  4.74 6.86 0 top
U9  W25Q128JVSIQ  [SOIC-8_L5.3-W5.3-P1.27-LS8.0-BL]  7.02 19.87 0 top

## Footprints (pads in the part's own frame, mm; a bottom-side part is the same pattern mirrored in y, then rotated)
C0402
  rect 0.79x0.54 smd: 1(-0.545,0) 2(0.545,0)
CRYSTAL-SMD_4P-L3.2-W2.5-BL
  rect 1.4x1.2 smd: 1(-1.1,-0.85) 2(1.1,-0.85) 3(1.1,0.85) 4(-1.1,0.85)
HDR-TH_2P-P2.54-V-F
  rect 1.7x1.7 hole 1: 1(-1.27,0)
  round 1.7 hole 1: 2(1.27,0)
LQFN-56_L7.0-W7.0-P0.4-EP
  rect 1.1x0.2 smd: 1(-3.55,2.6) 2(-3.55,2.2) 3(-3.55,1.8) 4(-3.55,1.4) 5(-3.55,1) 6(-3.55,0.6) 7(-3.55,0.2) 8(-3.55,-0.2) 9(-3.55,-0.6) 10(-3.55,-1) 11(-3.55,-1.4) 12(-3.55,-1.8) 13(-3.55,-2.2) 14(-3.55,-2.6) 29(3.55,-2.6) 30(3.55,-2.2) 31(3.55,-1.8) 32(3.55,-1.4) 33(3.55,-1) 34(3.55,-0.6) 35(3.55,-0.2) 36(3.55,0.2) 37(3.55,0.6) 38(3.55,1) 39(3.55,1.4) 40(3.55,1.8) 41(3.55,2.2) 42(3.55,2.6)
  rect 0.2x1.1 smd: 15(-2.6,-3.55) 16(-2.2,-3.55) 17(-1.8,-3.55) 18(-1.4,-3.55) 19(-1,-3.55) 20(-0.6,-3.55) 21(-0.2,-3.55) 22(0.2,-3.55) 23(0.6,-3.55) 24(1,-3.55) 25(1.4,-3.55) 26(1.8,-3.55) 27(2.2,-3.55) 28(2.6,-3.55) 43(2.6,3.55) 44(2.2,3.55) 45(1.8,3.55) 46(1.4,3.55) 47(1,3.55) 48(0.6,3.55) 49(0.2,3.55) 50(-0.2,3.55) 51(-0.6,3.55) 52(-1,3.55) 53(-1.4,3.55) 54(-1.8,3.55) 55(-2.2,3.55) 56(-2.6,3.55)
  rect 3.1x3.1 smd: 57(0,0)
QFN-48_L7.0-W7.0-P0.50-BL-EP5.6
  oval 0.28x0.79 smd: 1(-2.75,-3.408) 2(-2.25,-3.408) 3(-1.75,-3.408) 4(-1.25,-3.408) 5(-0.75,-3.408) 6(-0.25,-3.408) 7(0.25,-3.408) 8(0.75,-3.408) 9(1.25,-3.408) 10(1.75,-3.408) 11(2.25,-3.408) 12(2.75,-3.408) 25(2.75,3.408) 26(2.25,3.408) 27(1.75,3.408) 28(1.25,3.408) 29(0.75,3.408) 30(0.25,3.408) 31(-0.25,3.408) 32(-0.75,3.408) 33(-1.25,3.408) 34(-1.75,3.408) 35(-2.25,3.408) 36(-2.75,3.408)
  oval 0.79x0.28 smd: 13(3.408,-2.75) 14(3.408,-2.25) 15(3.408,-1.75) 16(3.408,-1.25) 17(3.408,-0.75) 18(3.408,-0.25) 19(3.408,0.25) 20(3.408,0.75) 21(3.408,1.25) 22(3.408,1.75) 23(3.408,2.25) 24(3.408,2.75) 37(-3.408,2.75) 38(-3.408,2.25) 39(-3.408,1.75) 40(-3.408,1.25) 41(-3.408,0.75) 42(-3.408,0.25) 43(-3.408,-0.25) 44(-3.408,-0.75) 45(-3.408,-1.25) 46(-3.408,-1.75) 47(-3.408,-2.25) 48(-3.408,-2.75)
  rect 5.6x5.6 smd: 49(0,0)
R0402
  rect 0.566x0.54 smd: 1(-0.433,0) 2(0.433,0)
SOIC-8_L5.3-W5.3-P1.27-LS8.0-BL
  oval 0.63x2.25 smd: 1(-1.905,-3.53) 2(-0.635,-3.53) 3(0.635,-3.53) 4(1.905,-3.53) 5(1.905,3.53) 6(0.635,3.53) 7(-0.635,3.53) 8(-1.905,3.53)
SOT-23-6_L2.9-W1.6-P0.95-LS2.8-TL
  rect 1.072x0.532 smd: 1(-1.149,0.95) 2(-1.149,0) 3(-1.149,-0.95) 4(1.149,-0.95) 5(1.149,0) 6(1.149,0.95)
TQFN-48_L7.0-W7.0-P0.50-TL-EP5.6
  rect 0.8x0.3 smd: 1(-3.5,2.751) 2(-3.5,2.251) 3(-3.5,1.75) 4(-3.5,1.251) 5(-3.5,0.75) 6(-3.5,0.252) 7(-3.5,-0.249) 8(-3.5,-0.75) 9(-3.5,-1.25) 10(-3.5,-1.75) 11(-3.5,-2.249) 12(-3.5,-2.748) 25(3.5,-2.748) 26(3.5,-2.249) 27(3.5,-1.75) 28(3.5,-1.25) 29(3.5,-0.75) 30(3.5,-0.249) 31(3.5,0.252) 32(3.5,0.75) 33(3.5,1.251) 34(3.5,1.75) 35(3.5,2.251) 36(3.5,2.751)
  rect 0.3x0.8 smd: 13(-2.751,-3.5) 14(-2.251,-3.5) 15(-1.75,-3.5) 16(-1.25,-3.5) 17(-0.75,-3.5) 18(-0.251,-3.5) 19(0.249,-3.5) 20(0.75,-3.5) 21(1.25,-3.5) 22(1.75,-3.5) 23(2.251,-3.5) 24(2.751,-3.5) 37(2.751,3.5) 38(2.251,3.5) 39(1.75,3.5) 40(1.25,3.5) 41(0.75,3.5) 42(0.251,3.5) 43(-0.251,3.5) 44(-0.75,3.5) 45(-1.25,3.5) 46(-1.75,3.5) 47(-2.251,3.5) 48(-2.751,3.5)
  rect 5.6x5.6 smd: 49(0,0.001)

## Nets
As in the schematic, except:
1.1V: C6.2 C7.2 C8.2 U6.23 U6.45 U6.50
3.3V: C9.2 C10.2 C11.2 C12.2 C13.2 C14.2 C15.2 C16.2 C17.2 R6.1 U6.1 U6.10 U6.22 U6.33 U6.42 U6.43 U6.44 U6.48 U6.49 U6.56 U9.1 U9.8

Pads without a net: R4 1; R5 1; U2 1 2 5 6 7 8 11 12 17 18 31 32 33 34 35 36 37 38 39 42 43 46 47 48 49; U5 1 2 3 4 5 6; U6 11 12 13 14 15 16 17 18 24 25 26 27 28 29 30 31 32 34 35 36 37 38; U7 1 2 3 4 5 6 7 8 9 10 11 12 13 14 15 16 17 18 19 20 21 22 23 24 25 26 27 28 29 30 31 32 33 34 39 40 41 46 47 48 49

# Board BBC_2024_REUSE
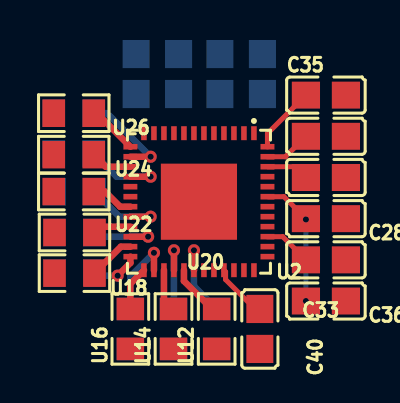
[diagram p5: board, top side]
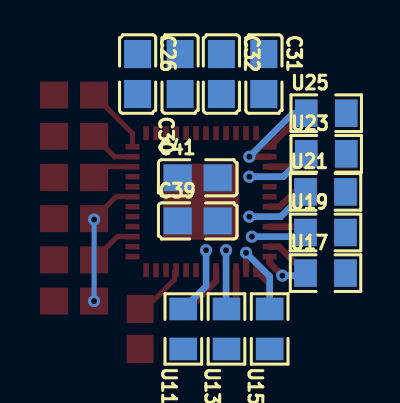
[diagram p6: board, bottom side, seen from below]

No outline. copper layers: Top Layer, Bottom Layer. Coordinates in mm from the lowest, leftmost part position.
Stack: Top Layer 0.035mm / Dielectric1 1.51mm FR4 er 4.5 / Bottom Layer 0.035mm

## Design rules (mm)
template: JLCPCB Capability(Two Layers Board)
spacing copperThickness1oz (default): track to track 0.102, other pairs 0.152 to 0.3
spacing copperThickness2oz: track to track 0.203, other pairs 0.152 to 0.3
track width copperThickness1oz (default): min 0.127, default 0.254, max 2.54
track width copperThickness2oz: min 0.203, default 0.254, max 2.54
differential pair differentialPair (default): width min 0.127, default 0.254, max 2.54; gap min 0.152, default 0.152
via viaSize (default): diameter min 0.5, default 0.61, max 10; hole min 0.3, default 0.305, max 6.3

## Placement (name value [footprint] x y rotation side)
C26  330nF  [C0805]  9.43 12.75 270 bottom
C28  100nF  [C0805]  12.61 5.52 180 top
C30  100nF  [C0805]  7.31 12.75 90 bottom
C31  100nF  [C0805]  3.12 12.75 270 bottom
C32  100nF  [C0805]  5.24 12.75 270 bottom
C33  100nF  [C0805]  12.61 3.46 0 top
C35  330nF  [C0805]  12.61 11.7 0 top
C36  100nF  [C0805]  12.61 1.4 180 top
C37  330nF  [C0805]  12.61 9.64 180 top
C38  100nF  [C0805]  12.61 7.58 180 top
C39  100nF  [C0805]  6.43 5.4 180 bottom
C40  100nF  [C0805]  9.31 0 90 top
C41  100nF  [C0805]  6.43 7.56 180 bottom
U2  MAX5864ETM+  [QFN-48_L7.0-W7.0-P0.50-BL-EP5.1]  6.26 6.37 180 top
U11  100  [R0805]  7.15 0 90 bottom
U12  100  [R0805]  7.15 0 90 top
U13  100  [R0805]  4.99 0 90 bottom
U14  100  [R0805]  4.99 0 90 top
U15  100  [R0805]  2.83 0 90 bottom
U16  100  [R0805]  2.83 0 90 top
U17  100  [R0805]  0.04 2.79 180 bottom
U18  100  [R0805]  0.04 2.79 180 top
U19  100  [R0805]  0.04 4.83 180 bottom
U20  100  [R0805]  0.04 4.83 180 top
U21  100  [R0805]  0.04 6.86 180 bottom
U22  100  [R0805]  0 6.88 180 top
U23  100  [R0805]  0 8.76 180 bottom
U24  100  [R0805]  0 8.72 180 top
U25  100  [R0805]  0 10.8 180 bottom
U26  100  [R0805]  0 10.8 180 top

## Footprints (pads in the part's own frame, mm; a bottom-side part is the same pattern mirrored in y, then rotated)
C0805
  rect 1.41x1.35 smd: 1(-1,0) 2(1,0)
QFN-48_L7.0-W7.0-P0.50-BL-EP5.1
  rect 0.28x0.7 smd: 1(-2.75,-3.428) 2(-2.25,-3.428) 3(-1.75,-3.428) 4(-1.25,-3.428) 5(-0.75,-3.428) 6(-0.25,-3.428) 7(0.25,-3.428) 8(0.75,-3.428) 9(1.25,-3.428) 10(1.75,-3.428) 11(2.25,-3.428) 12(2.75,-3.428) 25(2.75,3.428) 26(2.25,3.428) 27(1.75,3.428) 28(1.25,3.428) 29(0.75,3.428) 30(0.25,3.428) 31(-0.25,3.428) 32(-0.75,3.428) 33(-1.25,3.428) 34(-1.75,3.428) 35(-2.25,3.428) 36(-2.75,3.428)
  rect 0.7x0.28 smd: 13(3.428,-2.75) 14(3.428,-2.25) 15(3.428,-1.75) 16(3.428,-1.25) 17(3.428,-0.75) 18(3.428,-0.25) 19(3.428,0.25) 20(3.428,0.75) 21(3.428,1.25) 22(3.428,1.75) 23(3.428,2.25) 24(3.428,2.75) 37(-3.428,2.75) 38(-3.428,2.25) 39(-3.428,1.75) 40(-3.428,1.25) 41(-3.428,0.75) 42(-3.428,0.25) 43(-3.428,-0.25) 44(-3.428,-0.75) 45(-3.428,-1.25) 46(-3.428,-1.75) 47(-3.428,-2.25) 48(-3.428,-2.75)
  rect 3.81x3.81 smd: 49(0,0)
R0805
  rect 1.133x1.377 smd: 1(-1,0) 2(1,0)

## Nets
As in the schematic.

Pads without a net: U2 17 38 49

## Via types
v1: diameter 0.61, hole 0.305, Top Layer to Bottom Layer, 10 vias

## Routing (per net, layer and track width the routed paths; a pad name or vN(x,y) marks a point on that pad's centre or on a via; arc(x,y) is an arc through that point)
VCC: length 13.9
  Top Layer w0.254: U2.43 10.51,6.62 C28.2 v1(11.61,5.48) ; U2.33 7.59,2.86 7.59,2.47 9.07,1 C40.2 ; U2.46 11.07,8.12 C38.2 ; U2.39 10.45,4.62 C33.1
  Bottom Layer w0.254: v1(11.61,1.4) v1(11.61,5.48)
$1N1602: length 2.3
  Top Layer w0.254: C37.2 10.59,8.62 U2.47
$1N1605: length 4.4
  Top Layer w0.33: U2.30 v1(6.01,3.94)
  Bottom Layer w0.33: v1(6.01,3.94) 6.01,2.14 U11.2
$1N1608: length 2.8
  Top Layer w0.33: U2.29 5.51,2.4 6.91,1 U12.2
$1N1611: length 3.9
  Top Layer w0.33: U2.28 v1(5.01,3.94)
  Bottom Layer w0.33: v1(5.01,3.94) 5.01,1.02 U13.2
$1N1614: length 2.1
  Top Layer w0.33: U14.2 4.51,1.48 U2.27
$1N1617: length 4.2
  Top Layer w0.33: U2.26 v1(4.01,3.81)
  Bottom Layer w0.33: U15.2 2.83,2.63 v1(4.01,3.81)
$1N1620: length 2.2
  Top Layer w0.33: U2.25 2.83,2.26 U16.2
$1N1625: length 2.4
  Top Layer w0.33: U2.24 2.83,3.31 v1(2.19,2.67)
  Bottom Layer w0.33: v1(2.19,2.67) 1.16,2.67 U17.1
$1N1628: length 2.3
  Top Layer w0.33: U2.23 2.36,4.12 U18.1
$1N1633: length 1.9
  Top Layer w0.33: U2.21 1.33,5.12 U20.1
$1N1636: length 4.3
  Top Layer w0.33: U2.20 v1(3.85,5.62)
  Bottom Layer w0.33: U21.1 2.28,5.62 v1(3.85,5.62)
$1N1639: length 2.1
  Top Layer w0.33: U2.19 2.32,6.12 1.56,6.88 U22.1
$1N1642: length 4.3
  Top Layer w0.33: U2.16 v1(3.85,7.62)
  Bottom Layer w0.33: U23.1 2.15,7.62 v1(3.85,7.62)
$1N1645: length 2.1
  Top Layer w0.33: U24.1 1.6,8.12 U2.15
$1N1648: length 4.8
  Top Layer w0.33: U2.14 v1(3.85,8.62)
  Bottom Layer w0.33: U25.1 1.67,10.8 v1(3.85,8.62)
$1N1651: length 2.5
  Top Layer w0.33: U2.13 1.16,10.8 U26.1
$1N1653: length 3.4
  Top Layer w0.254: C35.1 9.69,9.78 U2.48
$1N1662: length 3.7
  Top Layer w0.33: U2.22 v1(3.72,4.62)
  Bottom Layer w0.33: v1(3.72,4.62) 1.25,4.62 U19.1
